# Altium schematic sheet Sheet_MCU.SchDoc
size A4; SheetNumber: 1; SheetTotal: 4
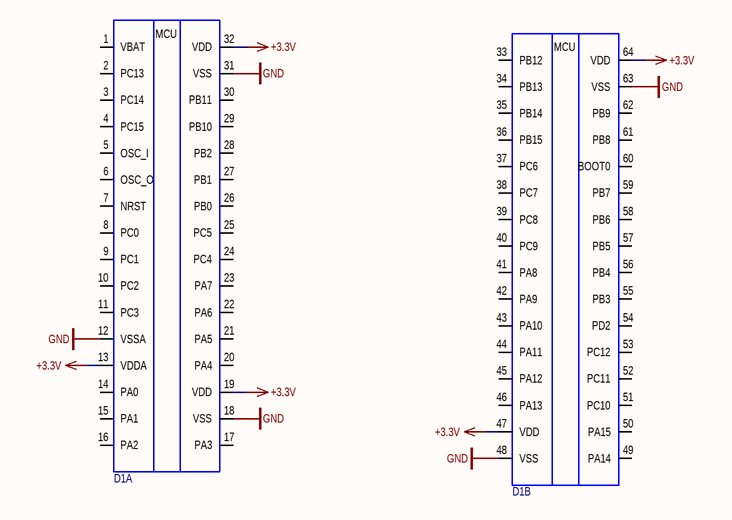
[diagram p0: Sheet_MCU.SchDoc]

## Parts
D1  STM32f107RCT6  [LQFP-64]  (value not drawn)  (parts A,B of 2)

## Nets
+3.3V: D1.13(VDDA) D1.19(VDD) D1.32(VDD) D1.47(VDD) D1.64(VDD)
GND: D1.12(VSSA) D1.18(VSS) D1.31(VSS) D1.48(VSS) D1.63(VSS)

Not connected (* = marked no-connect by the designer): D1 1(VBAT) 2(PC13) 3(PC14) 4(PC15) 5(OSC_I) 6(OSC_O) 7(NRST) 8(PC0) 9(PC1) 10(PC2) 11(PC3) 14(PA0) 15(PA1) 16(PA2) 17(PA3) 20(PA4) 21(PA5) 22(PA6) 23(PA7) 24(PC4) 25(PC5) 26(PB0) 27(PB1) 28(PB2) 29(PB10) 30(PB11) 33(PB12) 34(PB13) 35(PB14) 36(PB15) 37(PC6) 38(PC7) 39(PC8) 40(PC9) 41(PA8) 42(PA9) 43(PA10) 44(PA11) 45(PA12) 46(PA13) 49(PA14) 50(PA15) 51(PC10) 52(PC11) 53(PC12) 54(PD2) 55(PB3) 56(PB4) 57(PB5) 58(PB6) 59(PB7) 60(BOOT0) 61(PB8) 62(PB9)

## Notes on the sheet
- THIS DOCUMENT AND THE DATA DISCLOSED HEREIN OR
- HEREWITH IS THE PROPERTY OF ALTIUM LIMITED AND MAY
- DWG NO:
- REVISION
- REV:
- DESCRIPTION
- DATE
- APPROVED
- BE FREELY DISTRIBUTED IN WHOLE. NO RIGHTS ARE
- RESERVED OR EXPRESS OR IMPLIED WARANTEE GIVEN.
- ENG:
- APPROVALS
- PROJECT
- DSN:
- CHK:
- REFERENCE DOCUMENTS
- PROJECT REVISION:
- TITLE
- DOCUMENT REVISION:
- DESIGN ITEM:
- BOM:
- FAB DWG:
- PCB DWG:
- ASSY DWG:
- SCALE:
- A3
- SIZE
- CAGE CODE
- FILE NAME
- DWG NO.
- SHEET
- OF
- REV
- (in symbol STM32f107RCT6, part A) MCU
- (in symbol STM32f107RCT6, part B) MCU

## Library data of the parts
D1 = STM32f107RCT6: Manufacturer 1: STMicroelectronics; Manufacturer Part Number 1: STM32F107RCT6